# EAGLE design robot (EAGLE 8.6.0)
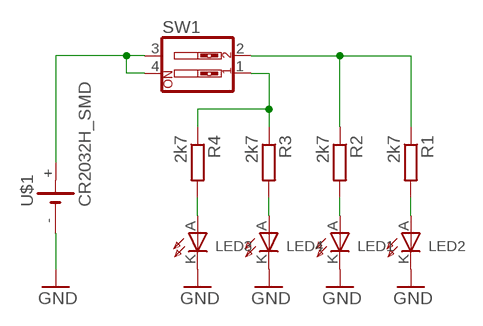
[diagram p0: schematic, sheet 1]

## Parts
LED1  LEDREAR  [3MM_REAR]
LED2  LEDREAR  [3MM_REAR]
LED3  LED3MMH  [3MM_H]
LED4  LED3MMH  [3MM_H]
R1  2k7  R-EU_0204/7  [0204/7]
R2  2k7  R-EU_0204/7  [0204/7]
R3  2k7  R-EU_0204/7  [0204/7]
R4  2k7  R-EU_0204/7  [0204/7]
SW1  SW_DIP-2  [EDG-02]
U$1  CR2032H_SMD  [CR2032H_SMD]

## Nets
GND: LED1.K LED2.K LED3.K LED4.K U$1.-
N$21: LED4.A R3.2
N$22: LED3.A R4.2
N$27: R1.1 R2.1 SW1.2
N$28: R3.1 R4.1 SW1.1
N$29: SW1.3 SW1.4 U$1.+
N$30: LED1.A R2.2
N$31: LED2.A R1.2

## Library data of the parts
LED1-LED4 = HA_LED_6:LED
R1-R4 = rcl:R-EU_: RESISTOR, European symbol; SPICEPREFIX: R
SW1 = special:SW_DIP-2: DIP SWITCH
U$1 = battery:CR2032H_SMD

## Board
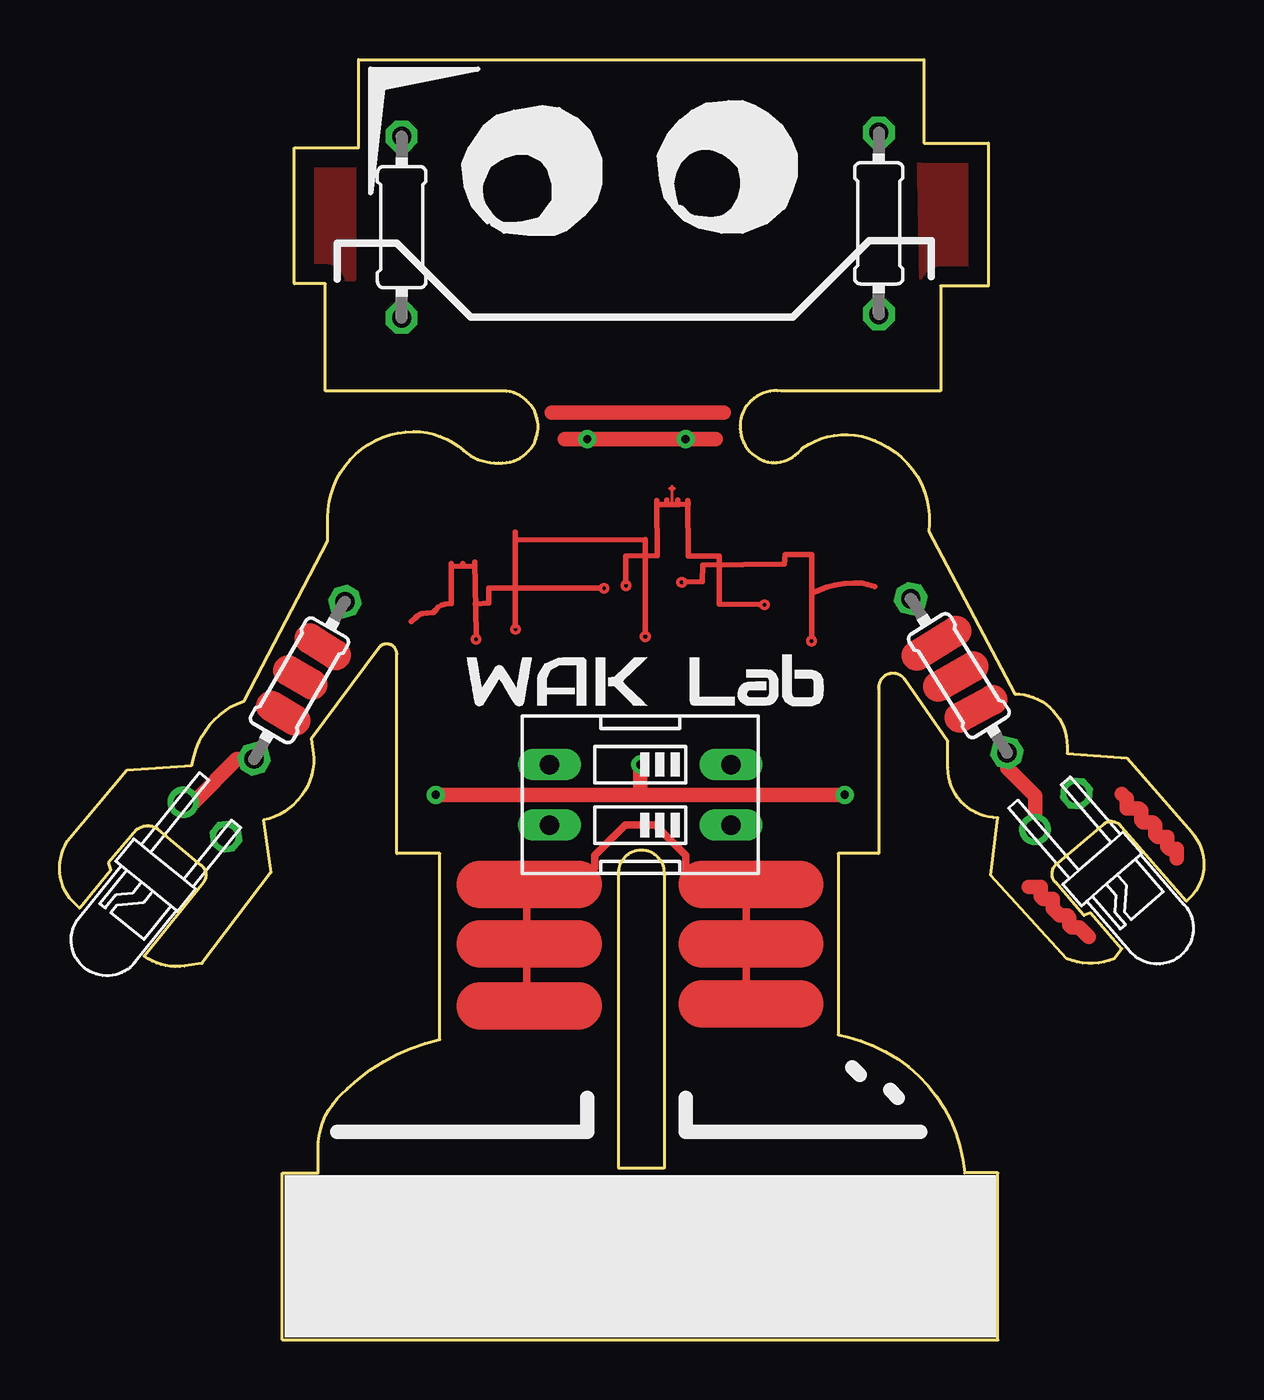
[diagram p1: board, top side]
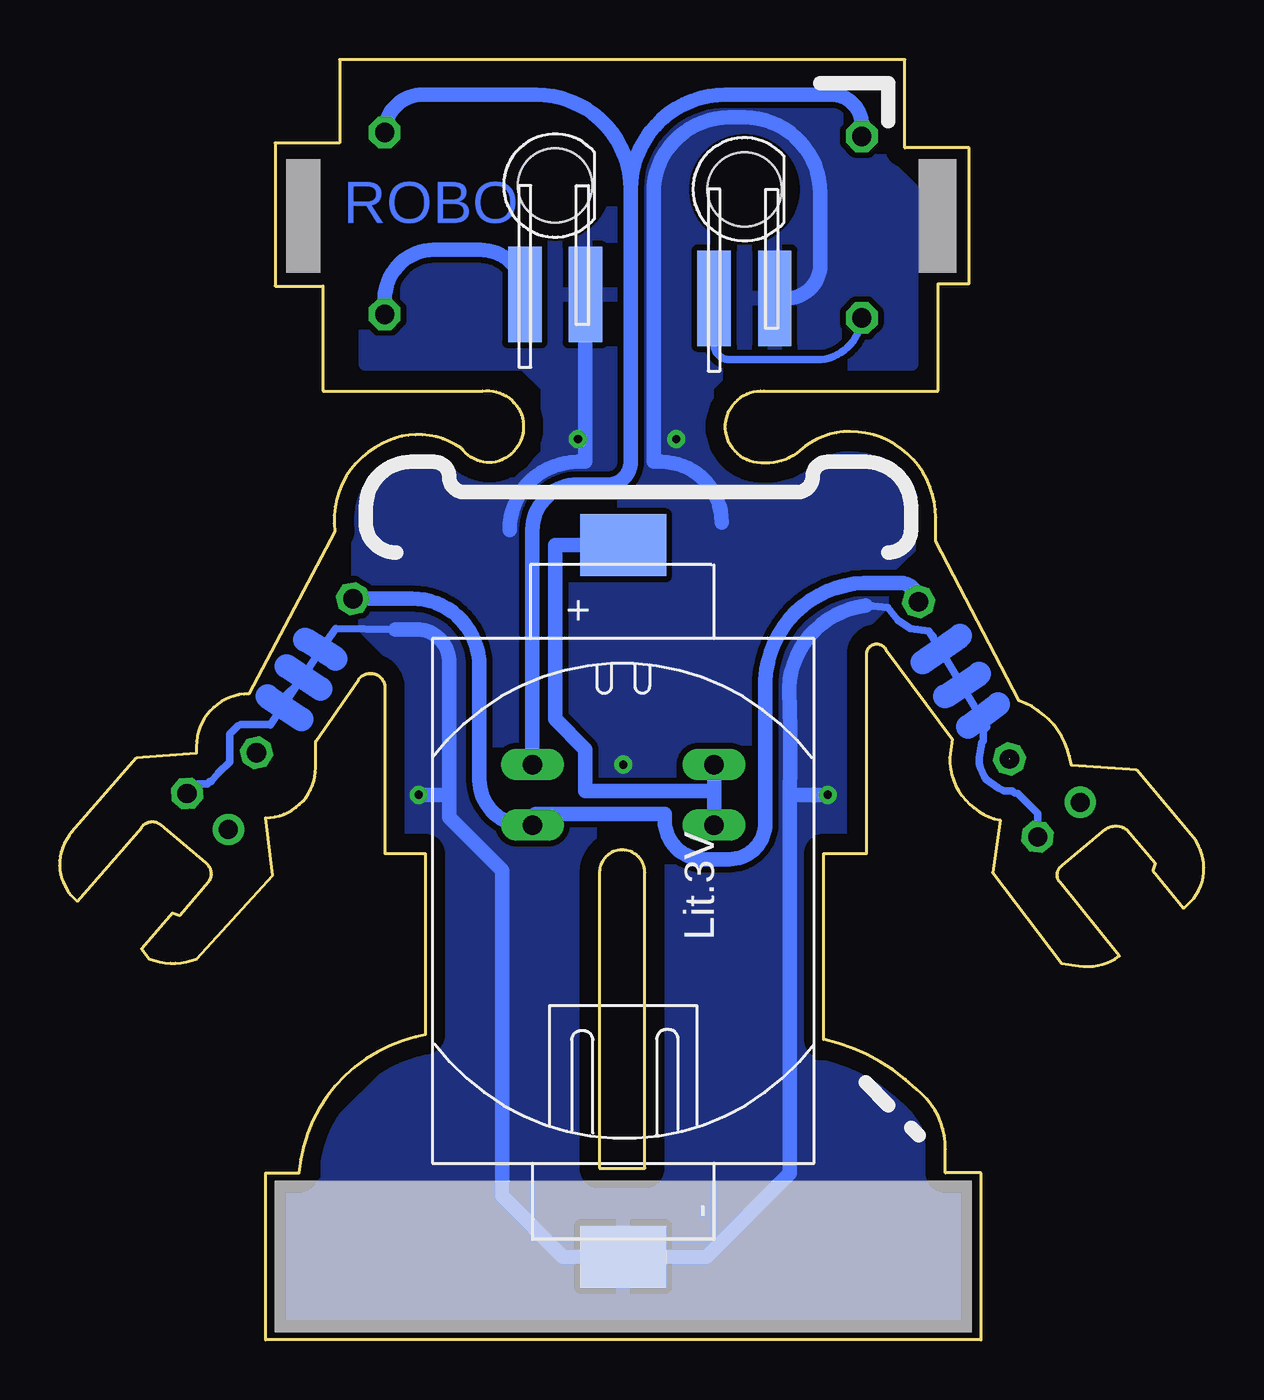
[diagram p2: board, bottom side, seen from below]

Size 47.98 x 53.7 mm. Coordinates in mm from the lower left corner, seen from the top.
Outline: 9.34,0 39.34,0 39.34,7 37.94,7 arc73 33.04,12.7 32.64,12.8 32.64,20.4 34.34,20.4 34.34,27.3 arc-151 35.44,27.7 37.24,25.1 37.24,24 arc90 39.34,21.9 39.04,19.48 42.22,15.98 arc44 44.22,15.98 44.54,16.4 43.24,17.9 42.94,17.8 41.74,19.2 arc-95 41.84,20 43.74,21.6 arc-98 44.54,21.5 47.24,18.4 arc93 47.46,21.3 44.76,24.4 42.24,24.6 42.24,24.9 arc90 40.04,27.1 36.44,33.9 arc72 34.44,37.6 arc63 31.14,37.4 arc-53 29.94,36.8 29.84,36.8 arc-180 30.24,39.8 36.94,39.8 36.94,44.2 38.94,44.2 38.94,50.2 36.24,50.2 36.24,53.7 12.54,53.7 12.54,50 9.84,50 9.84,44.3 11.14,44.3 11.14,39.8 18.44,39.8 arc-177 18.74,36.8 arc-14 18.04,36.8 arc-35 16.94,37.3 arc42 14.84,38.1 arc90 11.24,34.5 11.24,33.5 7.74,26.8 arc57 5.64,24.5 5.54,24.1 2.82,23.9 0.32,20.92 arc69 0.42,18.52 0.84,18.1 2.14,19.7 2.04,20 3.24,21.4 arc-77 4.14,21.4 5.94,19.9 arc-94 6.04,19.2 3.54,16.1 arc45 5.24,15.68 5.96,15.78 8.86,19.6 8.54,21.8 arc79 10.66,24.42 10.54,25.2 13.34,28.96 arc-152 14.14,28.77 14.14,20.4 15.94,20.4 15.94,12.6 arc32 12.04,10.5 arc53 10.84,8 10.84,7 9.34,7 9.34,0
Outline: 23.44,7.2 23.44,19.6 arc-180 25.34,19.6 25.34,7.2 23.44,7.2
Copper layers (1*16): Top 0.035mm / dielectric 1.5mm / Bottom 0.035mm
Design rules "default *": minimum track width 6mil, minimum drill 0.35mm, track to track 6mil, track to pad 6mil, pad to pad 6mil, via to via 6mil, smd to smd 6mil, copper to edge 30mil, drill to drill 6mil, minimum pad ring 10mil, minimum via ring 8mil, stop-mask expansion 4mil, vias tented up to drill 0mil, thermal gap 10mil

### Footprints (pad centres in the part's own frame; a part is rotated, then mirrored left to right if it is on the bottom)
3MM_REAR = smd 4 x 1.4: A 4.572,-1.27; K 4.572,1.27 | hole 3.1: 0,0
3MM_H = drill 0.8: A 0,-1.15 | drill 0.8 octagon: K 0,1.15
0204/7 = drill 0.813 octagon: 1 -3.81,0; 2 3.81,0
EDG-02 = drill 0.813 long: 1 -1.27,-3.81; 2 1.27,-3.81; 3 1.27,3.81; 4 -1.27,3.81
CR2032H_SMD = smd 2.6 x 3.6: + -14.922,0; - 14.922,0

### Placement (x,y rotation side)
LED1  27.2,48.42 270 bottom
LED2  19.26,48.26 270 bottom
LED3  41.77,22.17 311 top
LED4  6.08,21.83 231 top
R1  14.34,46.67 270 top
R2  34.35,46.83 270 top
R3  10.06,27.67 240 top
R4  37.7,27.86 302 top
SW1  24.34,22.86 90 top
U$1  24.34,18.41 270 bottom

### Tracks (layer width: path | path; a pad name or v marks a point on that pad's centre or on a via)
GND  (via drill 0.35)
  Top 0.61: v15.77,22.86 24.34,22.86 | 24.34,22.86 v32.92,22.86 | 24.34,22.86 v24.34,24.13 | 21.17,37.78 v22.12,37.78 v26.25,37.78 27.52,37.78
  Bottom 0.305: LED3.K 42.24,23.32 41.78,23.32 41.69,23.41 41.62,23.42 41.33,23.77 40.85,24.25 40.85,25.41 40.53,25.74 40.52,25.74 40.37,25.81 40.03,25.81 40.02,25.82 39.14,25.82 39.14,25.8 38.73,26.42 | 38.73,26.42 36.8,29.26 | 36.8,29.26 36.41,29.84 33.91,29.8 | LED4.K 6.97,22.08 7.8,22.91 7.82,22.91 7.93,22.93 8.03,23.03 8.38,23.03 8.41,23.04 8.62,23.15 9.11,23.5 9.21,23.64 9.37,24.01 9.41,24.17 9.41,24.41 9.31,25.06 9.25,25.12 9.25,25.57 9.1,25.72 9.33,26.09 | 9.33,26.09 10.2,27.54 | 10.2,27.54 11.02,28.89 | 11.02,28.89 11.53,29.73 | 11.53,29.73 11.35,29.5 | 11.53,29.73 12.31,29.83 12.84,30.2 13.26,30.72 13.88,30.78 14.18,30.8 | 8.63,26.67 8.75,26.67 9.33,26.09 | 9.42,27.94 9.8,27.94 10.2,27.54 | 10.22,29.53 10.38,29.53 11.02,28.89 | 36.41,28.57 36.8,28.97 36.8,29.26 | 38.47,28.26 37.94,27.72 37.94,27.58 38.53,26.99 39.27,26.99 38.73,26.45 38.73,26.42
  Bottom 0.61: 31.65,22.86 31.65,21.91 29.42,19.68 29.42,6.03 26.88,3.49 U$1.- 20.85,3.49 17.36,6.99 17.36,22.86 | LED2.K 17.49,43.69 arc-90 16.09,45.09 16.09,48.1 arc-90 19.26,51.28 19.9,51.28 arc-90 23.07,48.1 23.07,36.83 22.76,36.83 arc90 20.22,34.29 | LED1.K 25.93,36.83 26.25,36.83 arc-90 29.11,33.97 | 33.91,29.8 32.87,29.8 arc90 31.65,28.26 31.65,22.86 | 14.18,30.8 arc-91 17.36,26.67 arc1 17.36,22.86 | 17.36,22.86 v15.77,22.86 | v32.92,22.86 31.65,22.86
  Bottom 1.016: 9.9,25.72 8.63,26.67 | 10.85,26.99 9.42,27.94 | 11.8,28.42 10.22,29.53 | 37.68,29.37 36.41,28.57 | 37.04,27.3 38.47,28.26 | 39.27,26.99 37.84,26.04
  pour Bottom (isolate 0.254): 13.55,52.7 35.14,52.7 35.14,40.96 28.47,40.96 27.52,40.01 27.52,37.78 27.52,37.15 28.79,35.88 30.38,35.88 31.01,35.88 31.96,36.83 34.19,36.83 35.14,35.88 35.46,35.56 35.46,33.66 35.46,30.16 33.55,28.26 33.55,21.27 31.96,21.27 31.96,12.38 32.28,12.06 32.6,11.75 33.55,11.75 36.73,8.57 36.73,6.67 37.04,6.35 38.63,6.35 38.63,0.64 10.06,0.64 10.06,6.35 11.33,6.35 11.64,6.67 11.64,8.57 14.5,11.43 15.77,11.43 16.41,11.43 16.72,11.75 16.72,13.34 16.72,21.27 14.82,21.27 14.82,29.53 13.23,31.11 13.23,32.38 11.96,33.66 11.96,35.24 12.6,35.88 13.87,37.15 15.45,37.15 15.77,37.15 16.72,36.2 19.9,36.2 20.53,36.83 20.85,37.15 20.85,40.01 19.9,40.96 12.6,40.96 12.28,40.96 12.28,48.26 13.23,49.21 13.23,52.39
N$1
  Top 0.23: 23.73,31.8 23.73,32.88 25.05,32.89 25.04,35.2 25.04,35.03 25.47,35.04 | 25.46,35.22 25.47,35.04 | 25.47,35.04 25.92,35.04 | 25.92,35.04 25.93,35.04 25.92,35.22 25.92,35.04 | 25.92,35.04 26.35,35.05 26.34,35.2 26.36,32.88 27.65,32.88 27.65,30.86 29.35,30.84
N$2
  Top 0.127: 25.57,35.71 25.78,35.71
N$3
  Top 0.127: 25.69,35.03 25.68,35.81
N$4
  Top 0.23: 31.53,29.5 31.53,32.95 30.42,32.95 30.38,32.55 26.96,32.5 26.95,31.8 26.25,31.78
N$5
  Top 0.23: 24.55,29.7 24.55,33.56 19.13,33.54
N$6
  Top 0.23: 19.1,29.96 19.1,33.88
N$7
  Top 0.23: 31.55,31.32 31.91,31.48 32.16,31.58 32.51,31.67 32.89,31.73 33.31,31.75 33.62,31.74 33.89,31.69 34.17,31.59
N$8
  Top 0.23: 22.65,31.53 17.99,31.53 18,30.9 17.42,30.86
N$9
  Top 0.24: 14.74,30.13 14.9,30.28 arc-24 15.2,30.46 15.42,30.49 15.66,30.5 15.76,30.62 15.87,30.73 16.01,30.82 16.19,30.87 16.39,30.89 16.42,30.89 16.42,32.43 | 17.46,29.63 17.4,32.63 17.4,32.43 16.91,32.45 16.91,32.57 16.92,32.45 16.42,32.43 | 16.42,32.57 16.42,32.43
N$11
  Top 0.61: 44.54,22.9 44.74,22.7 44.74,22.3 45.24,22.3 45.34,22.2 45.34,21.8 45.44,21.7 45.84,21.7 45.94,21.6 45.94,21.2 46.04,21.1 46.44,21.1 46.44,20.7 46.54,20.6 46.84,20.6 46.84,20.2
N$12
  Top 1.27: 10.48,29.42 11.58,28.72
N$13
  Top 1.27: 9.58,28.08 10.58,27.48
N$14
  Top 1.27: 8.88,26.58 9.88,25.98
N$15
  Top 1.27: 37.74,26.1 39.1,26.84
N$16
  Top 1.27: 36.84,27.4 38.3,28.24
N$17
  Top 1.27: 35.94,28.7 37.6,29.74
N$18
  Top 0.61: 40.64,19 41.14,19 41.14,18.6 41.24,18.5 41.64,18.5 41.64,18.1 41.94,17.8 42.24,17.8 42.34,17.7 42.34,17.4 42.44,17.3 42.74,17.3 43.14,16.9
N$21  (1 unrouted)
  Top 0.152: 8.15,24.38 R3.2
  Top 0.61: R3.2 7.43,24.36 5.62,22.55 LED4.A
N$22
  Top 0.61: LED3.A 40.9,22.81 39.72,23.99 R4.2
N$23
  pour Top: 9.94,49.9 12.34,49.9 12.34,44.5 9.94,44.5
N$24
  pour Top: 36.04,50 38.84,50 38.84,44.3 36.14,44.3
N$25
  Top 0.61: 20.64,38.9 27.84,38.9
N$27
  Bottom 0.61: R1.1 14.34,50.96 arc-90 15.61,52.23 20.06,52.23 arc-90 24.03,48.26 | R2.1 arc90 32.76,52.23 28,52.23 arc90 24.03,48.26 | 24.03,48.26 24.03,36.83 arc90 24.98,35.88 26.25,35.88 arc-90 28.15,33.97 SW1.2
N$28
  Bottom 0.61: R3.1 arc-90 12.75,31.75 14.26,31.75 arc-90 18.39,27.3 18.39,21.67 arc90 19.9,20.16 21.17,20.16 arc90 22.6,22.07 28,22.07 | 28,22.07 arc-90 SW1.1 | R4.1 33.21,31.09 arc90 30.38,28.26 30.38,23.5 arc-90 28.47,21.59 28,22.07
N$29
  Bottom 0.61: SW1.4 20.53,23.02 | 20.53,24.45 SW1.3 20.53,23.02 | 20.53,23.02 25.93,23.02 25.93,24.77 27.2,26.04 27.2,33.34 U$1.+
N$30
  Bottom 0.61: R2.2 34.35,43.66 arc90 32.28,45.72 30.34,45.72 arc90 LED1.A
N$31
  Bottom 0.305: LED2.A 20.53,41.75 arc-90 19.9,41.12 16.41,41.12 arc-90 R1.2
N$101
  Top 0.305: 17.64,19.1 18.31,18.43 18.31,18.41 19.58,18.41 19.58,16.6 | 17.64,16.6 17.68,16.57 17.68,16.19 19.58,16.19 19.58,14 | 28.79,16.6 28.79,18.73 27.2,18.73 27.2,18.84 26.94,19.1 26.89,19.05 26.25,19.05 26.25,20.32 24.98,21.59 23.71,21.59 22.44,20.32 22.44,19.8 21.74,19.1 | 26.94,16.6 27.2,16.34 27.2,16.19 28.79,16.19 28.79,14.1
  Top 2: 31.04,19.1 26.94,19.1 | 17.64,16.6 19.58,16.6 21.74,16.6 | 17.64,14 19.58,14 21.74,14 | 17.64,19.1 21.74,19.1 | 26.94,16.6 28.79,16.6 31.04,16.6 | 26.94,14.1 28.79,14.1 31.04,14.1
(copper drawn outside any net)
  shapes: Top circle x8

### Text on the board
Bottom: ROBO
bStop: ROBO